# EAGLE design MAX86141_HEG_MINI (EAGLE 9.6.2)
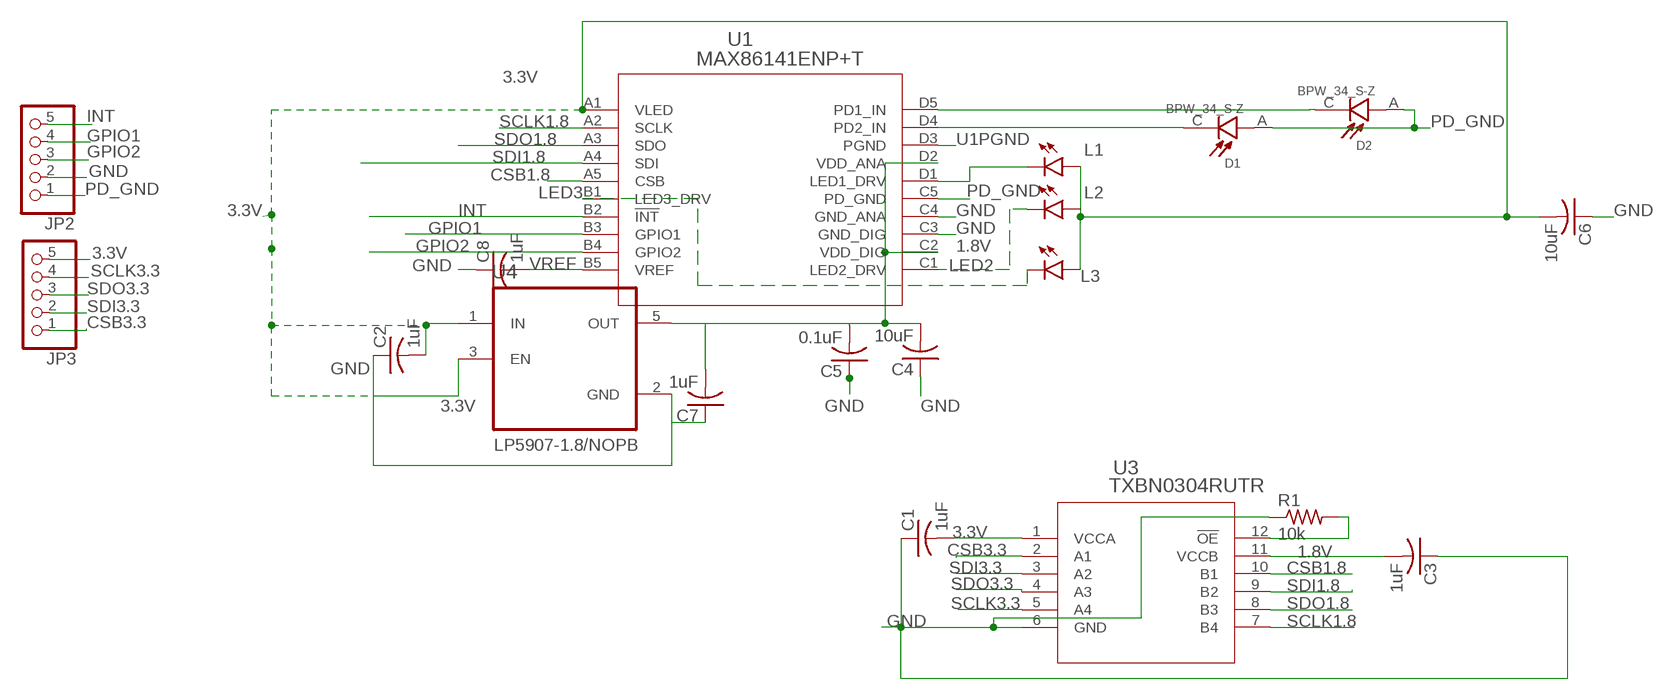
[diagram p0: schematic, sheet 1]

## Parts
C1  1uF  C-USC0402  [C0402]
C2  1uF  C-USC0402  [C0402]
C3  1uF  C-USC0402  [C0402]
C4  10uF  C-USC0402  [C0402]
C5  0.1uF  C-USC0402  [C0402]
C6  10uF  C-USC0402  [C0402]
C7  1uF  C-USC0402  [C0402]
C8  1uF  C-USC0402  [C0402]
D1  BPW_34_S-Z  [DIO_BPW_34_S-Z]
D2  BPW_34_S-Z  [DIO_BPW_34_S-Z]
JP2  PINHD-1X5  [1X05]
JP3  PINHD-1X5  [1X05]
L1  LEDCHIPLED_1206  [CHIPLED_1206]
L2  LEDCHIPLED_1206  [CHIPLED_1206]
L3  LEDCHIPLED_1206  [CHIPLED_1206]
R1  10k  R-US_R0402  [R0402]
U1  MAX86141ENP+T  [21-100134_N201A2-1_MXM]
U3  TXBN0304RUTR  [RUT12]
U4  LP5907MFX-3.3/NOPB  [SOT95P280X145-5N]

## Nets
1.8V: C3.2 C4.2 C5.2 C7.2 U1.C2(VDD_DIG) U1.D2(VDD_ANA) U3.11(VCCB) U4.5(OUT)
3.3V: C1.2 C2.2 C6.2 JP3.5 L1.A L2.A L3.A U1.A1(VLED) U3.1(VCCA) U4.1(IN) U4.3(EN)
CSB1.8: U1.A5(CSB) U3.10(B1)
CSB3.3: JP3.1 U3.2(A1)
GND: C1.1 C2.1 C3.1 C4.1 C5.1 C6.1 C7.1 C8.1 JP2.2 R1.1 U1.C3(GND_DIG) U1.C4(GND_ANA) U3.6(GND) U4.2(GND)
GPIO1: JP2.4 U1.B3(GPIO1)
GPIO2: JP2.3 U1.B4(GPIO2)
INT: JP2.5 U1.B2(!INT)
LED1: L1.C U1.D1(LED1_DRV)
LED2: L2.C U1.C1(LED2_DRV)
LED3: L3.C U1.B1(LED3_DRV)
OE: R1.2 U3.12(!OE)
PD1_IN: D2.C U1.D5(PD1_IN)
PD2_IN: D1.C U1.D4(PD2_IN)
PD_GND: D1.A D2.A JP2.1 U1.C5(PD_GND)
SCLK1.8: U1.A2(SCLK) U3.7(B4)
SCLK3.3: JP3.4 U3.5(A4)
SDI1.8: U1.A4(SDI) U3.9(B2)
SDI3.3: JP3.2 U3.3(A2)
SDO1.8: U1.A3(SDO) U3.8(B3)
SDO3.3: JP3.3 U3.4(A3)
U1PGND: U1.D3(PGND)
VREF: C8.2 U1.B5(VREF)

## Notes on the sheet
- LP5907-1.8/NOPB

## Library data of the parts
C1-C8 = adafruit:C-US: CAPACITOR, American symbol
D1 D2 = BPW_34_S-Z:BPW_34_S-Z: Silicon PIN Photodiode; DESCRIPTION: Photodiode 850nm 20ns 120° 2-SMD, Gull Wing; DIGI-KEY_PART_NUMBER: 475-2659-1-ND; DIGI-KEY_PURCHASE_URL: https://www.digikey.com/product-detail/en/osram-opto-semiconductors-inc/BPW-34-S-Z/475-2659-1-ND/1893861?utm_source=snapeda&utm_medium=aggregator&utm_campaign=symbol; MF: OSRAM Opto; MP: BPW 34 S-Z; PACKAGE: SMD-2 OSRAM Opto
JP2 JP3 = pinhead:PINHD-1X5: PIN HEADER
L1-L3 = led:LED: LED OSRAM: - CHIPLED LG R971, LG N971, LY N971, LG Q971, LY Q971, LO R971, LY R971 LH N974, LH R974 LS Q976, LO Q976, LY Q976 LO Q996 - Hyper CHIPLED LW Q18S LB Q993, LB Q99A, LB R99A - SideLED LS A670, LO A670, LY A670, LG A670, LP A670 LB A673, LV A673, LT A673, LW A673 LH A674 LY A675 LS A676, LA A676, LO A676, LY A676, LW A676 LS A679, LY A679, LG A679 - Hyper Micro SIDELED® LS Y876, LA Y876, LO Y876, LY Y876 LT Y87S - SmartLED LW L88C, LW L88S LB L89C, LB L89S, LG L890 LS L89K, LO L89K, LY L89K LS L896, LA L896, LO L896, LY L896 - TOPLED LS T670, LO T670, LY T670, LG T670, LP T670 LSG T670, LSP T670, LSY T670, LOP T670, LYG T670 LG T671, LOG T671, LSG T671 LB T673, LV T673, LT T673, LW T673 LH T674 LS T676, LA T676, LO T676, LY T676, LB T676, LH T676, LSB T676, LW T676 LB T67C, LV T67C, LT T67C, LS T67K, LO T67K, LY T67K, LW E67C LS E67B, LA E67B, LO E67B, LY E67B, LB E67C, LV E67C, LT E67C LW T67C LS T679, LY T679, LG T679 LS T770, LO T770, LY T770, LG T770, LP T770 LB T773, LV T773, LT T773, LW T773 LH T774 LS E675, LA E675, LY E675, LS T675 LS T776, LA T776, LO T776, LY T776, LB T776 LHGB T686 LT T68C, LB T68C - Hyper Mini TOPLED® LB M676 - Mini TOPLED Santana® LG M470 LS M47K, LO M47K, LY M47K Source: http://www.osram.convergy.de LUXEON: - LUMILED® LXK2-PW12-R00, LXK2-PW12-S00, LXK2-PW14-U00, LXK2-PW14-V00 LXK2-PM12-R00, LXK2-PM12-S00, LXK2-PM14-U00 LXK2-PE12-Q00, LXK2-PE12-R00, LXK2-PE12-S00, LXK2-PE14-T00, LXK2-PE14-U00 LXK2-PB12-K00, LXK2-PB12-L00, LXK2-PB12-M00, LXK2-PB14-N00, LXK2-PB14-P00, LXK2-PB14-Q00 LXK2-PR12-L00, LXK2-PR12-M00, LXK2-PR14-Q00, LXK2-PR14-R00 LXK2-PD12-Q00, LXK2-PD12-R00, LXK2-PD12-S00 LXK2-PH12-R00, LXK2-PH12-S00 LXK2-PL12-P00, LXK2-PL12-Q00, LXK2-PL12-R00 Source: www.luxeon.com KINGBRIGHT: KA-3528ASYC Source: www.kingbright.com
R1 = adafruit:R-US_: RESISTOR, American symbol
U1 = MAX86141:MAX86141ENP+T; BUILT_BY: EMA_UL_Team; COPYRIGHT: Copyright (C) 2018 Accelerated Designs. All rights reserved; MANUFACTURER_PART_NUMBER: MAX86141ENP+T; REVISION: 1; SOURCELIBRARY: Maxim_2018-11-30; VENDOR: Maxim Integrated Products
U3 = TXBN0304:TXBN0304RUTR; BUILT_BY: EMA_UL_Team; MANUFACTURER_PART_NUMBER: TXBN0304RUTR; VENDOR: Texas Instruments
U4 = LP5907MFX-3.3_NOPB:LP5907MFX-3.3/NOPB: IC REG LINEAR 3.3V 250MA SOT23; AVAILABILITY: Unavailable; DESCRIPTION: Linear Voltage Regulator IC 1 Output 250mA SOT-23-5; MF: Texas Instruments; MP: LP5907MFX-3.3/NOPB; PACKAGE: SOT-23 Texas Instruments; PRICE: None

## Board
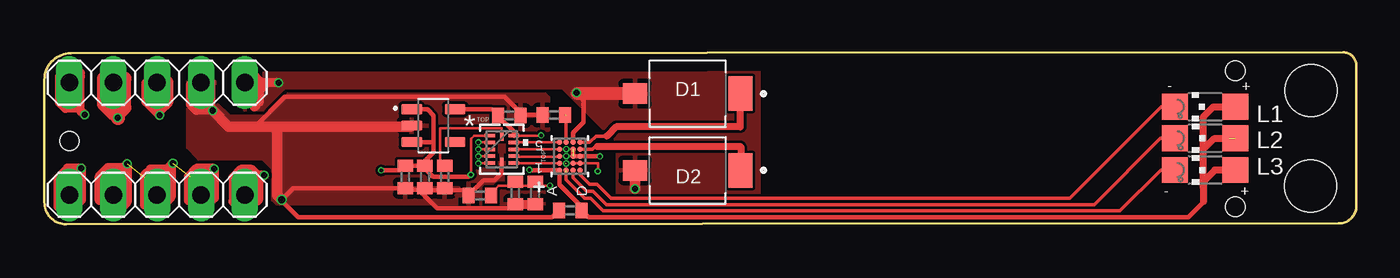
[diagram p1: board, top side]
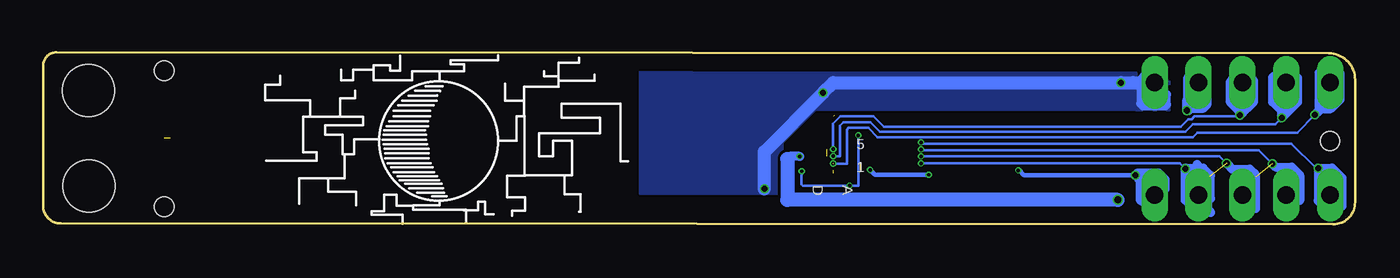
[diagram p2: board, bottom side, seen from below]

Size 76 x 9.96 mm. Coordinates in mm from the lower left corner, seen from the top.
Outline: 1.52,9.91 75.24,9.96 arc-90 76,9.19 76,1.07 arc-90 74.98,0.05 1.27,0 arc-90 0,1.27 0,8.38 arc-90 1.52,9.91
Copper layers (1*16): Top 0.035mm / dielectric 1.5mm / Bottom 0.035mm
Design rules "default *": minimum track width 6mil, minimum drill 0.35mm, track to track 6mil, track to pad 6mil, pad to pad 6mil, via to via 2mil, smd to smd 6mil, copper to edge 40mil, drill to drill 6mil, minimum pad ring 10mil, minimum via ring 3mil, stop-mask expansion 4mil, vias tented up to drill 0mil, thermal gap 10mil
Holes 1.1 mm at 1.45,4.83 68.99,1.02 68.99,8.89
Holes 3 mm at 73.38,7.75 73.36,2.21

### Footprints (pad centres in the part's own frame; a part is rotated, then mirrored left to right if it is on the bottom)
C0402 = smd 0.7 x 0.9: 1 -0.65,0; 2 0.65,0
DIO_BPW_34_S-Z = smd 1.4 x 1.2: A -3.05,0 | smd 1.4 x 2: C 3.05,0
1X05 = drill 1.016 long: 1 -5.08,0; 2 -2.54,0; 3 0,0; 4 2.54,0; 5 5.08,0
CHIPLED_1206 = smd 1.5 x 1.5: A 0,-1.75; C 0,1.75
R0402 = smd 0.7 x 0.9: 1 -0.65,0; 2 0.65,0
21-100134A_20 = smd 0.305 x 0.305: A1 -0.8,0.6; A2 -0.4,0.6; A3 0,0.6; A4 0.4,0.6; A5 0.8,0.6; B1 -0.8,0.2; B2 -0.4,0.2; B3 0,0.2; B4 0.4,0.2; B5 0.8,0.2; C1 -0.8,-0.2; C2 -0.4,-0.2; C3 0,-0.2; C4 0.4,-0.2; C5 0.8,-0.2; D1 -0.8,-0.6; D2 -0.4,-0.6; D3 0,-0.6; D4 0.4,-0.6; D5 0.8,-0.6
RUT12 = smd 0.6 x 0.2: 1 -0.7,0.8; 2 -0.7,0.4; 3 -0.7,0; 4 -0.7,-0.4; 5 -0.7,-0.8; 7 0.7,-0.8; 8 0.7,-0.4; 9 0.7,0; 10 0.7,0.4; 11 0.7,0.8 | smd 0.2 x 0.6: 6 0,-0.8; 12 0,0.8
SOT95P280X145-5N = smd 1.21 x 0.59: 1 -1.255,0.95; 2 -1.255,0; 3 -1.255,-0.95; 4 1.255,-0.95; 5 1.255,0.95

### Placement (x,y rotation side)
C1  20.9,2.74 90 top
C2  22.05,2.74 90 top
C3  25.22,1.68 0 top
C4  27.28,1.8 90 top
C5  28.42,1.8 90 top
C6  30.45,0.81 0 top
C7  26.92,6.3 180 top
C8  29.51,6.32 0 top
D1  37.26,3.12 0 top
D2  37.26,7.57 0 top
JP2  6.53,8.2 180 top
JP3  6.53,1.7 0 top
L1  67.23,6.81 90 top
L2  67.24,4.98 90 top
L3  67.24,3.14 90 top
R1  23.19,2.74 90 top
U1  MAX86141ENP+T  [21-100134A_20]  30.43,3.94 90 top
U3  26.49,4.34 0 top
U4  22.53,5.71 0 top

### Tracks (layer width: path | path; a pad name or v marks a point on that pad's centre or on a via)
1.8V  (via drill 0.2)
  Top 0.152: U1.C2 U1.D2 32.05,3.54 v32.05,3.07 | v28.78,5.16 28.77,5.14 U3.11 | C3.2 25.87,1.79 26.31,2.23 27.31,2.23 | v29.29,2.23 28.24,2.23 | 28.24,2.23 27.31,2.23 | 25.89,6.67 26.26,6.3 C7.2 | C5.2 28.24,2.28 28.24,2.23 | C4.2 27.28,2.26 27.31,2.23
  Top 0.254: U3.11 27.19,5.37 26.26,6.3 | U4.5 25.89,6.67
  Bottom 0.152: v32.05,3.07 32.05,2.31 31.98,2.23 v29.29,2.23 28.78,2.23 v28.78,5.16
3.3V  (via drill 0.2, 0.35)  (1 unrouted)
  Top 0.152: v24.7,2.87 24.7,4.95 24.89,5.14 U3.1 | U4.3 | 68.99,3.48 L3.A | 22.05,3.67 C2.2 22.1,3.34 22.1,3.16 | C1.2 20.64,3.12 | v28.1,3.14 v28.09,3.15
  Top 0.254: v24.7,2.87 24.57,2.74 22.52,2.74 22.1,3.16 | 22.05,3.67 22.56,4.18 22.56,4.76 | 22.56,4.76 22.56,6.3 22.19,6.67 U4.1 | C2.2 C1.2 | 20.64,3.12 v19.51,3.12 | v28.1,3.14 U1.A1 29.83,2.29 31.1,1.02 C6.2 31.51,0.41 66.25,0.41 67.16,1.31 | U4.3 22.56,4.76
  Top 0.406: L3.A 67.79,3.14 67.16,2.51 67.16,2.11 | 67.16,2.11 67.14,2.09 67.14,4.34 | 67.16,1.31 67.16,2.11 | 68.63,4.98 67.78,4.98 67.14,4.34 | 67.14,4.34 67.14,6.24 67.7,6.81 L1.A
  Top 0.508: v12.74,2.83 JP3.5 11.25,1.35 10.92,1.35 | v12.74,2.83 11.62,2.83 11.61,2.82 | v12.74,2.83 12.41,2.5 12.41,1.41 12.34,1.35 11.58,1.35 | v12.74,2.83 12.36,2.83 12.01,3.17 11.38,3.17 10.92,2.72 10.92,1.35 | 10.92,1.35 10.92,1.32 11.23,1.02
  Bottom 0.254: v28.09,3.15 27.81,2.87 v24.7,2.87 | v19.51,3.12 19.46,3.12 19.18,2.84 12.78,2.84 12.76,2.83 v12.74,2.83
  Bottom 0.508: v12.74,2.83 12.59,2.98 11.39,2.98 11,2.59 11,2.06 11.35,1.7 JP3.5 | v12.74,2.83 11.53,1.63 | v12.74,2.83 12.46,2.55 12.46,1.43 12.37,1.35 11.79,1.35
CSB1.8
  Top 0.152: U1.A5 28.85,4.75 28.85,4.74 U3.10
CSB3.3  (via drill 0.2, 0.35)
  Top 0.152: U3.2 v25.15,4.74 v25.15,4.75
  Top 0.508: v2.13,3.25 2.13,1.4 1.75,1.02 1.45,1.32 JP3.1 | v2.13,3.25 1.45,2.56 JP3.1 | v2.13,3.25 1.35,3.25 0.79,2.69 0.79,1.04 JP3.1
  Bottom 0.152: 1.42,1.57 1.42,2.44 1.49,2.5 | v25.15,4.75 25.07,4.67 3.68,4.67 2.27,3.26 2.13,3.26
  Bottom 0.508: 2.13,3.26 v2.13,3.25 | v2.13,3.25 1.49,2.6 1.49,2.5 | v2.13,3.25 2.13,1.37 1.88,1.12 | v2.13,3.25 1.32,3.25 0.76,2.69 0.76,1.07
GND  (via drill 0.2, 0.35, 0.4)  (1 unrouted)
  Top 0.152: C8.1 28.84,6.35 | 27.58,6.35 27.57,6.36 | C3.1 24.27,1.98 | 21.68,2.01 21.7,1.98 22,1.98 22,1.99 22.05,2.04 C2.1 | 21.02,2.01 20.93,2.09 C1.1 | 27.28,0.94 C4.1 27.29,1.17 | C7.1 27.57,6.36 | 27.57,6.36 27.57,6.46 | U4.2 20.85,5.71 | 28.41,1.17 C5.1 | R1.1 23.19,2.06 23.11,1.98 | v13.74,1.42 13.74,1.37
  Top 0.254: 28.84,6.35 27.58,6.35 | 27.57,6.46 26.66,7.38 13.91,7.38 12.19,5.66 | v32.18,3.94 U1.C3 U1.C4 | U3.6 26.49,2.96 26.07,2.54 25.44,2.54 C3.1 | 24.27,1.98 23.11,1.98 22,1.98 | 21.68,2.01 21.02,2.01 | 21.7,1.98 22.74,0.94 27.28,0.94 | C1.1 14.41,2.09 v13.74,1.42 | C6.1 29.4,0.41 14.71,0.41 13.74,1.37
  Top 0.508: C4.1 27.28,1.09 | 27.29,1.17 28.41,1.17 | 9.65,8.28 9.65,6.68 v9.74,6.59 8.8,6.59 8.46,6.93 8.46,8.1
  Top 0.61: U4.2 21.22,5.66 13.49,5.66 | 13.49,5.66 12.19,5.66 10.67,5.66 v9.74,6.59 9.07,7.26 JP2.2 | v13.74,1.42 13.49,1.68 13.49,5.66
  Bottom 0.508: 32.89,3.79 32.74,3.94 v32.18,3.94 | JP2.2 9.07,7.72 8.56,7.21 8.56,6.96 8.79,6.73 9.5,6.73 9.64,6.59 v9.74,6.59 9.74,7.23 9.68,7.29 9.68,8.51
  Bottom 0.813: 32.89,3.79 32.89,1.42 v13.74,1.42
  pour Top: 9.91,9.91 8.25,9.91 8.25,4.42 8.92,3.76 12.6,3.76 13.18,3.17 13.18,1.4 13.82,0.76 28.98,0.76 28.98,5.21 29.24,5.46 29.24,7.37 29.03,7.57 14.1,7.57 12.8,6.27 10.74,6.27 9.91,7.11
GPIO1  (via drill 0.2, 0.35)
  Top 0.508: v4.25,6.16 3.99,6.43 JP2.4
  Top 0.813: 3.99,6.43 3.45,6.96 3.45,8.43 | v4.25,6.16 4.25,6.39 4.62,6.76 4.62,8.46
  Bottom 0.152: v4.25,6.16 4.62,5.79 9.4,5.79 9.83,5.36 27.51,5.36 28.07,5.92 29.63,5.92 29.83,5.71 29.83,3.94 U1.B3
  Bottom 0.508: v4.25,6.16 3.99,6.43 3.99,7.47 | v4.25,6.16 4.25,6.57 4.78,7.09 4.78,8.51 4.72,8.56 4.7,8.56 4.52,8.38 | v4.25,6.16 3.33,7.09 3.33,8.48 3.4,8.56 3.53,8.56
  other vias: 30.23,3.94
GPIO2  (via drill 0.2, 0.35)  (1 unrouted)
  Top 0.508: v6.67,6.31 6.67,6.57 7.21,7.11 7.21,8.26 6.96,8.51 | v6.67,6.31 6.67,7.53 6.55,7.64 | v6.67,6.31 5.89,7.09 5.89,8.18 6.27,8.56
  Bottom 0.152: v30.23,4.36 v30.24,4.37 30.24,5.82 29.81,6.25 27.89,6.25 27.31,5.66 10.08,5.66 9.65,6.1 9.45,6.1 9.3,6.25 6.73,6.25 v6.67,6.31
  Bottom 0.508: v6.67,6.31 6.53,6.45 JP2.3 | v6.67,6.31 6.67,6.51 7.21,7.06 7.21,8.28 7.11,8.38 | v6.67,6.31 5.87,7.11 5.87,8.31 6.12,8.56 6.58,8.56
INT  (via drill 0.2, 0.35)  (1 unrouted)
  Top 0.508: v2.32,6.34 1.45,7.21 JP2.5 | v2.32,6.34 1.94,6.72 1.21,6.72 0.86,7.06 0.86,8.56 1.22,8.56 1.35,8.43 1.35,8.3 JP2.5 | v2.32,6.34 2.08,6.58 2.08,8.56 | 2.08,8.56 2.08,8.76 | JP2.5 1.8,8.56 2.08,8.56
  Bottom 0.152: v30.23,3.52 30.21,3.5 29.44,3.5 29.44,5.49 29.34,5.59 28.19,5.59 27.66,5.05 9.4,5.05 9.14,5.31 3.35,5.31 v2.32,6.34
  Bottom 0.508: v2.32,6.34 1.45,7.21 JP2.5 | v2.32,6.34 2.08,6.58 2.08,8.56 | 2.08,8.56 2.08,8.76 | v2.32,6.34 1.97,6.69 1.41,6.69 0.86,7.24 0.86,8.74 0.91,8.74 JP2.5 | JP2.5 1.8,8.56 2.08,8.56
LED1
  Top 0.2: U1.D1 31.03,2.87 31.58,2.31 32,2.31 32.82,1.5 59.39,1.5 64.7,6.81 L1.C
LED2
  Top 0.152: 30.63,3.01 U1.C1
  Top 0.2: 30.63,2.69 30.63,3.01
  Top 0.203: L2.C 64.64,4.98 60.81,1.14 32.56,1.14 31.77,1.93 31.39,1.93 30.63,2.69
LED3  (1 unrouted)
  Top 0.203: L3.C 64.66,3.14 62.31,0.79 32.36,0.79 31.62,1.52 31.29,1.52 30.23,2.59 30.23,2.97
OE
  Top 0.152: R1.2 22.93,3.66 22.93,5.56 26.49,5.56 U3.12
PD1_IN
  Top 0.203: U1.D5 31.59,4.74 31.95,5.1 32.59,5.1
  Top 0.406: 32.59,5.1 33.12,5.64 40.31,5.64 D2.C
PD2_IN
  Top 0.203: U1.D4 31.75,4.35 31.9,4.5 32.03,4.5
  Top 0.406: D1.C 40.36,3.17 40.36,4.44 40.31,4.5 32.03,4.5
PD_GND  (via drill 0.35)
  Top 0.254: U1.C5 30.63,5.3 31.24,5.92 31.24,7.19 30.86,7.57
  Top 0.508: v13.56,8.2 12.9,8.2 | 12.9,8.2 12.57,8.2 12.22,8.56 11.89,8.56 | 12.9,8.2 12.45,7.75 12.45,7.09 12.17,6.81 11.46,7.52 11.46,8.05 JP2.1
  Top 0.61: D1.A v34.21,2.06 | 30.86,7.57 v30.82,7.61
  Top 0.762: D2.A 30.86,7.57
  Bottom 0.508: 12.42,8.2 12.42,7.01 12.27,6.86 11,6.86 10.92,6.93 10.92,7.52 | 12.85,8.2 12.6,8.2 12.24,8.56 12.12,8.56
  Bottom 0.762: v34.21,2.06 34.21,4.22 v30.82,7.61 30.23,8.2 v13.56,8.2 12.85,8.2 12.42,8.2
  pour Top: 33.17,1.78 41.43,1.78 41.43,9.93 11.58,9.93 11.58,6.6 12.67,6.6 13.94,7.87 30,7.87 33.17,4.7
  pour Bottom: 33.17,1.78 41.43,1.78 41.43,9.91 10.74,9.91 10.74,6.6 12.67,6.6 12.7,6.63 31.24,6.63 33.17,4.7
SCLK1.8
  Top 0.152: U1.A2 27.79,3.54 U3.7 27.18,3.53 U3.7
SCLK3.3  (via drill 0.2, 0.35)
  Top 0.152: U3.5 25.78,3.53 v25.15,3.53
  Top 0.508: 9.5,1.19 9.84,1.54 v9.84,3.21 9.82,3.24 8.8,3.24 8.33,2.77 8.33,1.37 8.74,1.37 JP3.4
  Bottom 0.152: v25.15,3.53 10.16,3.53 v9.84,3.21 | 9.07,2.44 9.07,1.78
  Bottom 0.508: v9.84,3.21 9.07,2.44 JP3.4 | v9.84,3.21 9.84,1.41 9.55,1.12 | v9.84,3.21 9.8,3.25 8.81,3.25 8.38,2.82 8.38,1.5 8.86,1.5 JP3.4 | JP3.4 9.42,1.35 9.55,1.35
SDI1.8
  Top 0.152: U1.A4 28.97,4.35 | 28.97,4.35 28.97,4.34 | 28.97,4.35 28.59,4.35 28.59,4.34 U3.9
SDI3.3  (via drill 0.2, 0.35)  (1 unrouted)
  Top 0.152: U3.3 v25.15,4.34
  Top 0.508: v4.79,3.52 3.99,2.72 JP3.2 3.66,1.37 3.18,1.37 3.18,2.79 3.67,3.29 4.56,3.29 v4.79,3.52 | v4.79,3.52 4.79,1.28 4.47,0.96
  Bottom 0.152: v25.15,4.34 25.1,4.29 5.56,4.29 v4.79,3.52
  Bottom 0.508: 5.77,2.72 5.77,0.91 6.57,1.71 | v4.79,3.52 4.58,3.31 3.67,3.31 3.2,2.84 3.2,1.37
SDO1.8
  Top 0.152: U1.A3 29.8,3.92 28.88,3.92 | 28.88,3.92 | 28.88,3.92 27.22,3.92 U3.8
SDO3.3  (via drill 0.2, 0.35)  (1 unrouted)
  Top 0.152: U3.4 v25.15,3.94
  Top 0.508: JP3.3 6.71,1.88 6.71,2.79 v7.44,3.53 | v7.44,3.53 7.11,3.2 6.15,3.2 5.79,2.84 5.79,1.35 | 5.79,1.35 5.79,1.12 | v7.44,3.53 7.34,3.43 7.34,1.57 6.83,1.07 | JP3.3 6.17,1.35 5.79,1.35 | JP3.3 6.83,1.4 6.83,1.35
  Bottom 0.152: v25.15,3.94 7.85,3.94 v7.44,3.53 | 8.36,0.69 8.36,2.69 8.41,2.74 8.43,2.74
  Bottom 0.508: 9.14,3.45 9.14,1.47 8.36,0.69 | v7.44,3.53 7.11,3.2 6.1,3.2 5.79,2.9 5.79,1.12
VREF  (1 unrouted)
  Top 0.203: U1.B5 30.23,6.3

### Text on the board
tPlace: - | + | TOP | TOP | L1 / L2 / L3 | - | +
Document: Flexible MAX86141 HEG Mini Prototype / Joshua Brewster - MIT License
tValuesAlt: C7 | C8 | INT | GPIO1 | GPIO2 | GND | PD_GND | P1 | MAX86141 HEG MINI Prototype (MIT License) / Designed By: Joshua Brewster | U2 | U3 | SS | MOSI | MISO | SCK | VDD | U1 | P2 | C1 | C2 | R1 | C3 | C4 | C5 | C6